# Altium schematic sheet [05] - POWER.SchDoc
size A
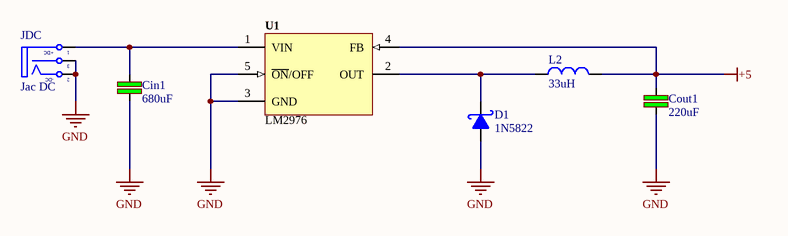
[diagram p0: [05] - POWER.SchDoc]

## Parts
Cin1  680uF  [CAP_D10]
Cout1  220uF  [CAP_D10]
D1  1N5822  [SMA]
JDC  Jac DC  [DC-IN]
L2  33uH  [L-SMD-M-7.3x4.5]
U1  LM2976  [TO-263]

## Nets
+5: Cout1.2 L2.2 U1.4(FB)
GND: Cin1.1 Cout1.1 D1.1(A) JDC.2(TN) JDC.3(S) U1.3(GND) U1.5(~{ON}/OFF)
NetCin1_2: Cin1.2 JDC.1(T) U1.1(VIN)
NetD1_2: D1.2(K) L2.1 U1.2(OUT)

## Notes on the sheet
- (in symbol DCIN) +DC; -DC

## Library data of the parts
Cin1 Cout1 = CAP: Cap np  1pF - 472pF; Value: 100pF
D1 = 1N5822: Schottky Rectifiers; Value: Diode c?m 1N5408
JDC = DCIN: Jac DC input; Value: Jac DC
L2 = Inductor: Value: 150 mH
U1 = LM2596: Max Input Voltage: 12 V; Max Output Current: 3 (6.0 peak) A; Max Output Voltage: mV; Category: IC-Power; Min Input Voltage: mV; Min Output Voltage: mV; Mounting Technology: Surface Mount; Status: Unreleased; Supply Voltage: mV; Temperature Range: -40 to +125 degC